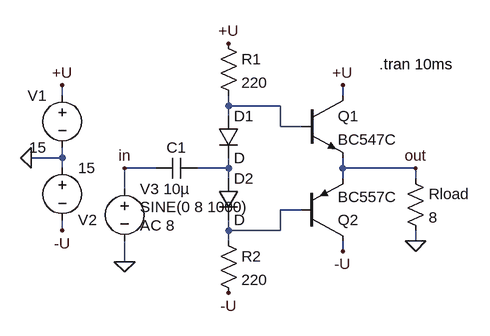
[diagram p0: schematic bipolar-biased.asc]
bipolar-biased.asc, the LTspice schematic file:
Version 4
SHEET 1 880 680
WIRE 96 64 96 48
WIRE 528 64 528 48
WIRE 352 80 352 64
WIRE 432 80 352 80
WIRE 352 96 352 80
WIRE 432 112 432 80
WIRE 464 112 432 112
WIRE 96 160 96 144
WIRE 96 160 48 160
WIRE 96 176 96 160
WIRE 240 176 192 176
WIRE 352 176 352 160
WIRE 352 176 304 176
WIRE 528 176 528 160
WIRE 640 176 528 176
WIRE 352 192 352 176
WIRE 528 192 528 176
WIRE 640 192 640 176
WIRE 192 208 192 176
WIRE 464 240 432 240
WIRE 96 272 96 256
WIRE 352 272 352 256
WIRE 432 272 432 240
WIRE 432 272 352 272
WIRE 352 288 352 272
WIRE 640 288 640 272
WIRE 528 304 528 288
WIRE 192 320 192 288
FLAG 48 160 0
FLAG 96 48 +U
FLAG 96 272 -U
FLAG 528 304 -U
FLAG 528 48 +U
FLAG 192 320 0
FLAG 640 288 0
FLAG 192 176 in
FLAG 640 176 out
FLAG 352 -16 +U
FLAG 352 368 -U
SYMBOL voltage 96 48 M0
WINDOW 123 0 0 Left 2
WINDOW 39 24 124 Left 2
SYMATTR InstName V1
SYMATTR Value 15
SYMBOL voltage 96 160 R0
WINDOW 0 24 96 Left 2
WINDOW 3 24 16 Left 2
WINDOW 123 0 0 Left 2
WINDOW 39 24 -12 Left 2
SYMATTR InstName V2
SYMATTR Value 15
SYMBOL npn 464 64 R0
SYMATTR InstName Q1
SYMATTR Value BC547C
SYMBOL pnp 464 288 M180
SYMATTR InstName Q2
SYMATTR Value BC557C
SYMBOL voltage 192 192 R0
WINDOW 3 24 44 Left 2
WINDOW 123 24 72 Left 2
WINDOW 39 24 180 Left 2
SYMATTR Value SINE(0 8 1000)
SYMATTR Value2 AC 8
SYMATTR InstName V3
SYMBOL res 624 176 R0
SYMATTR InstName Rload
SYMATTR Value 8
SYMBOL cap 304 160 R90
WINDOW 0 0 32 VBottom 2
WINDOW 3 32 32 VTop 2
SYMATTR InstName C1
SYMATTR Value 10µ
SYMBOL diode 336 96 R0
SYMATTR InstName D1
SYMBOL diode 336 192 R0
SYMATTR InstName D2
SYMBOL res 336 -32 R0
SYMATTR InstName R1
SYMATTR Value 220
SYMBOL res 336 272 R0
SYMATTR InstName R2
SYMATTR Value 220
TEXT 584 16 Left 2 !.tran 10ms

The netlist it stands for:
* bipolar-biased.asc
V1 +U 0 15
V2 0 -U 15
Q1 +U N001 out 0 BC547C
Q2 -U N003 out 0 BC557C
V3 in 0 SINE(0 8 1000) AC 8
Rload out 0 8
C1 N002 in 10µ
D1 N001 N002 D
D2 N002 N003 D
R1 +U N001 220
R2 N003 -U 220
.model D D
.lib standard.dio
.model NPN NPN
.model PNP PNP
.lib standard.bjt
.tran 10ms
.backanno
.end